# Altium schematic sheet Temp-RH_Sensor_Unit_board.SchDoc
size A2
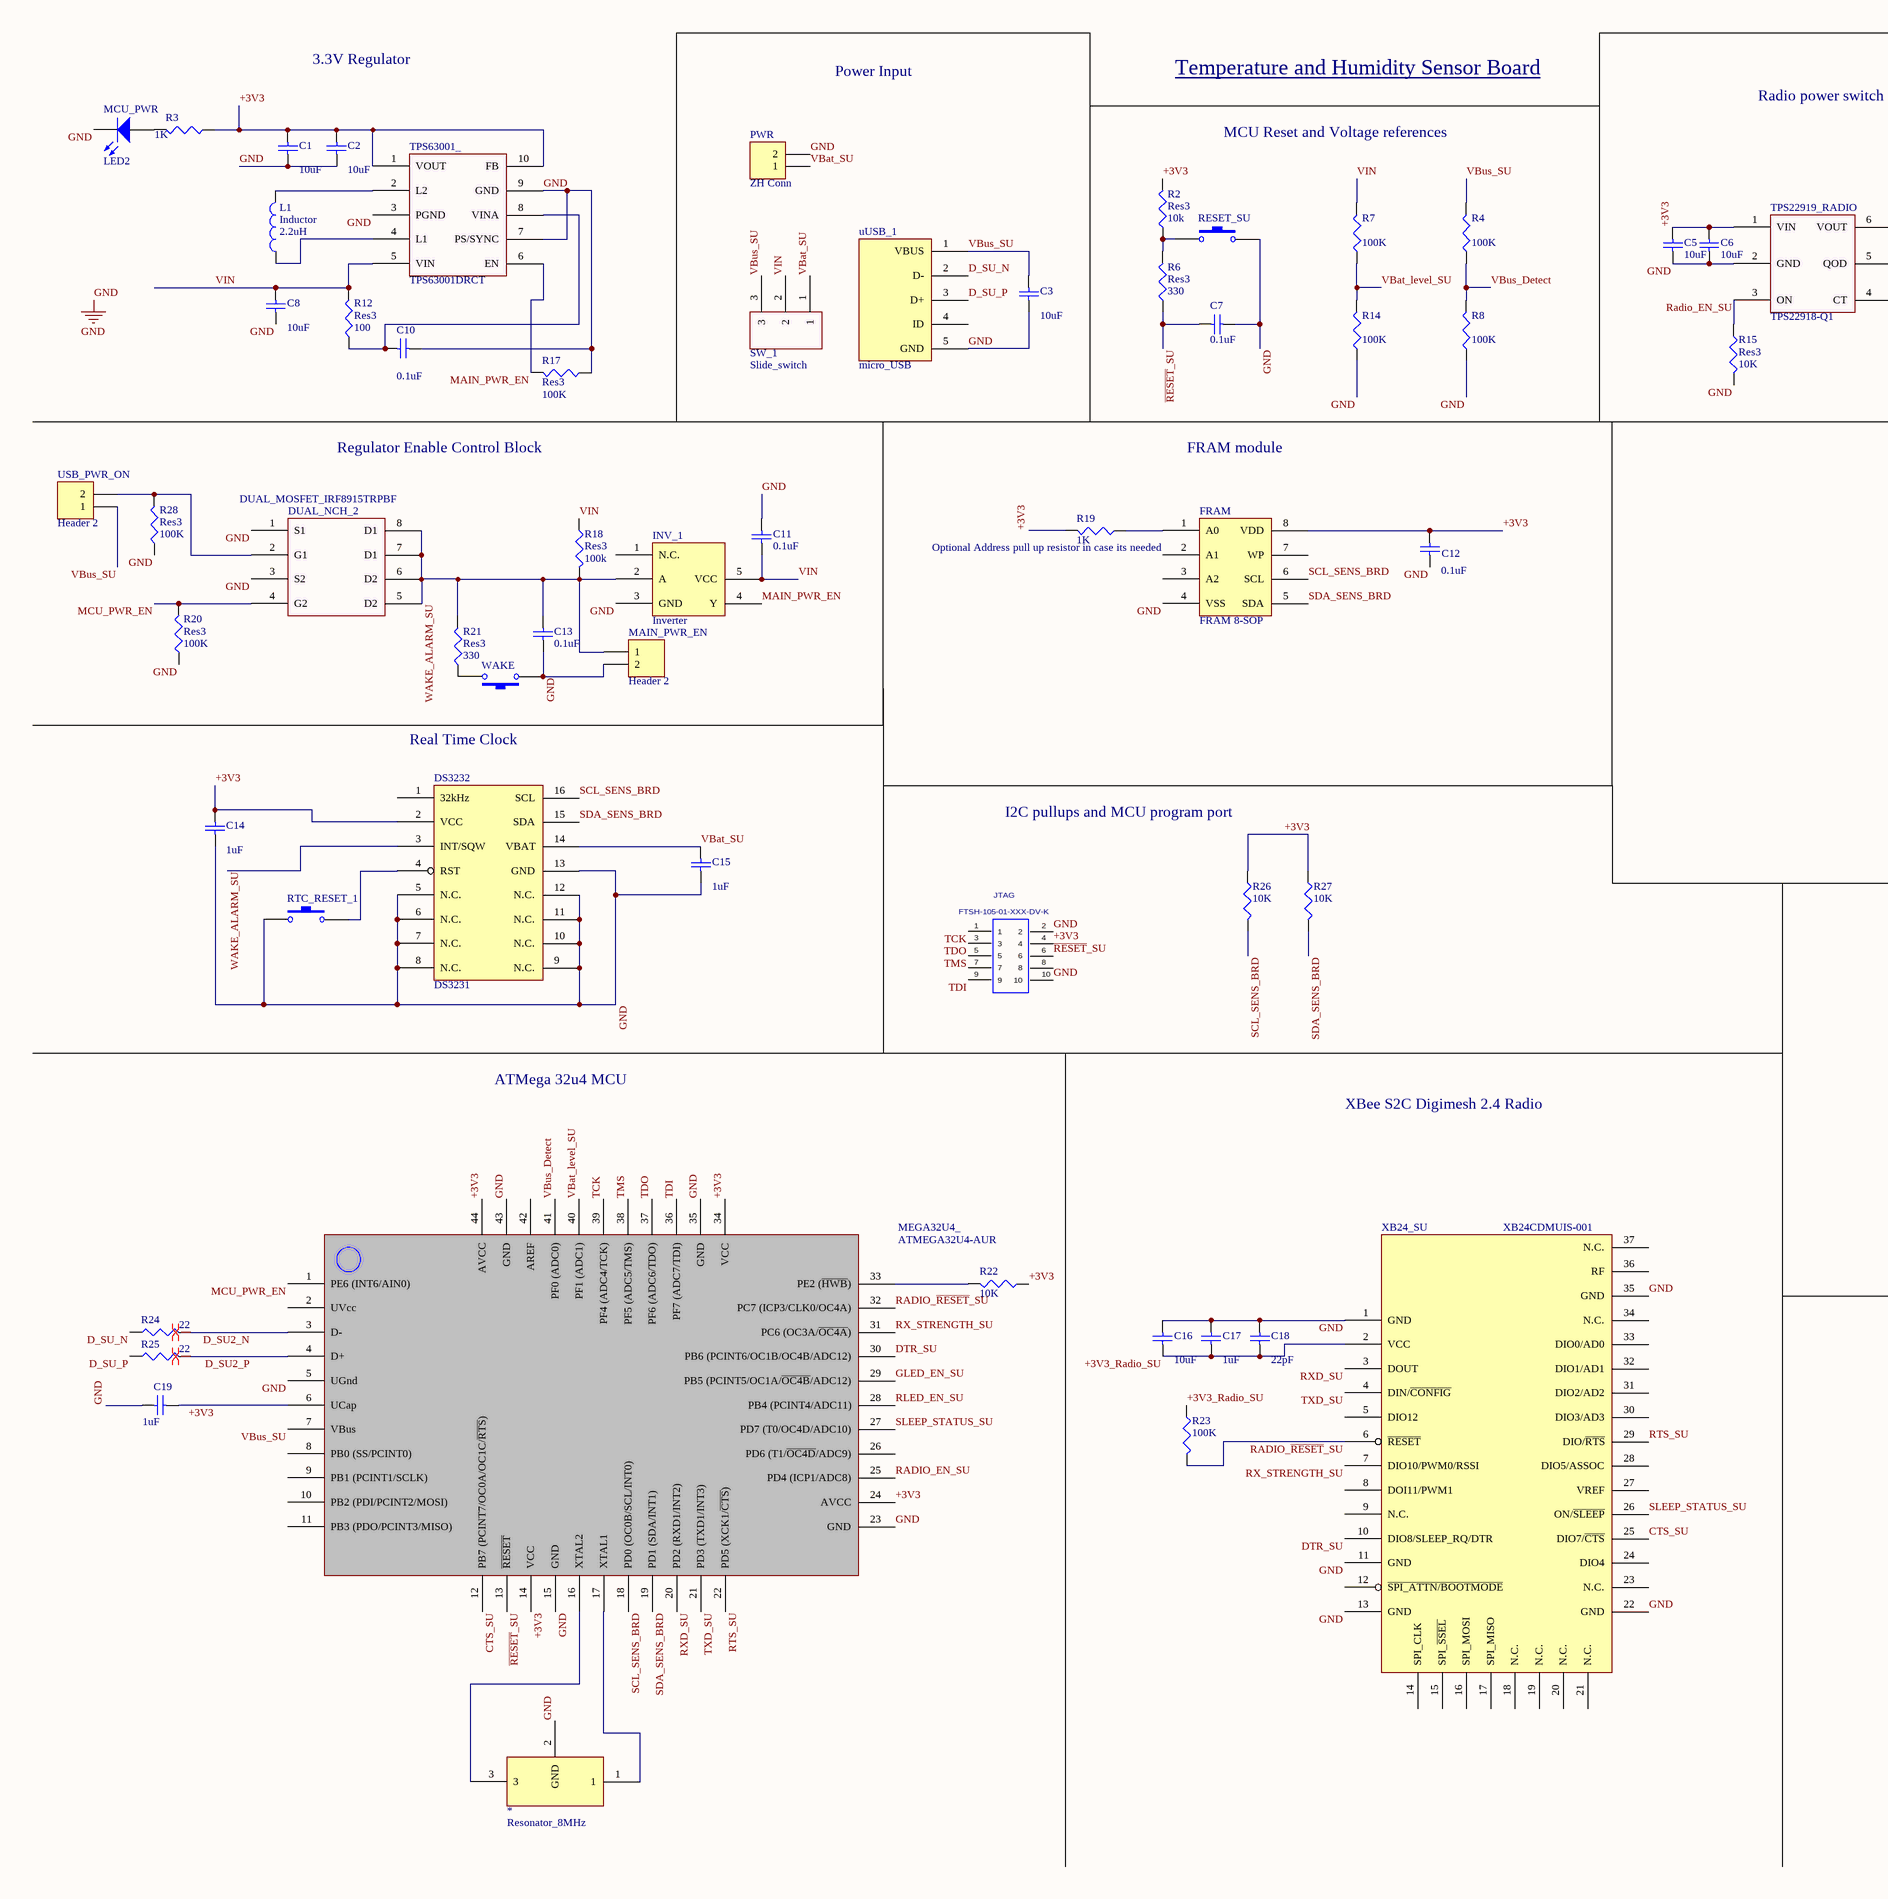
[diagram p0: Temp-RH_Sensor_Unit_board.SchDoc, left]
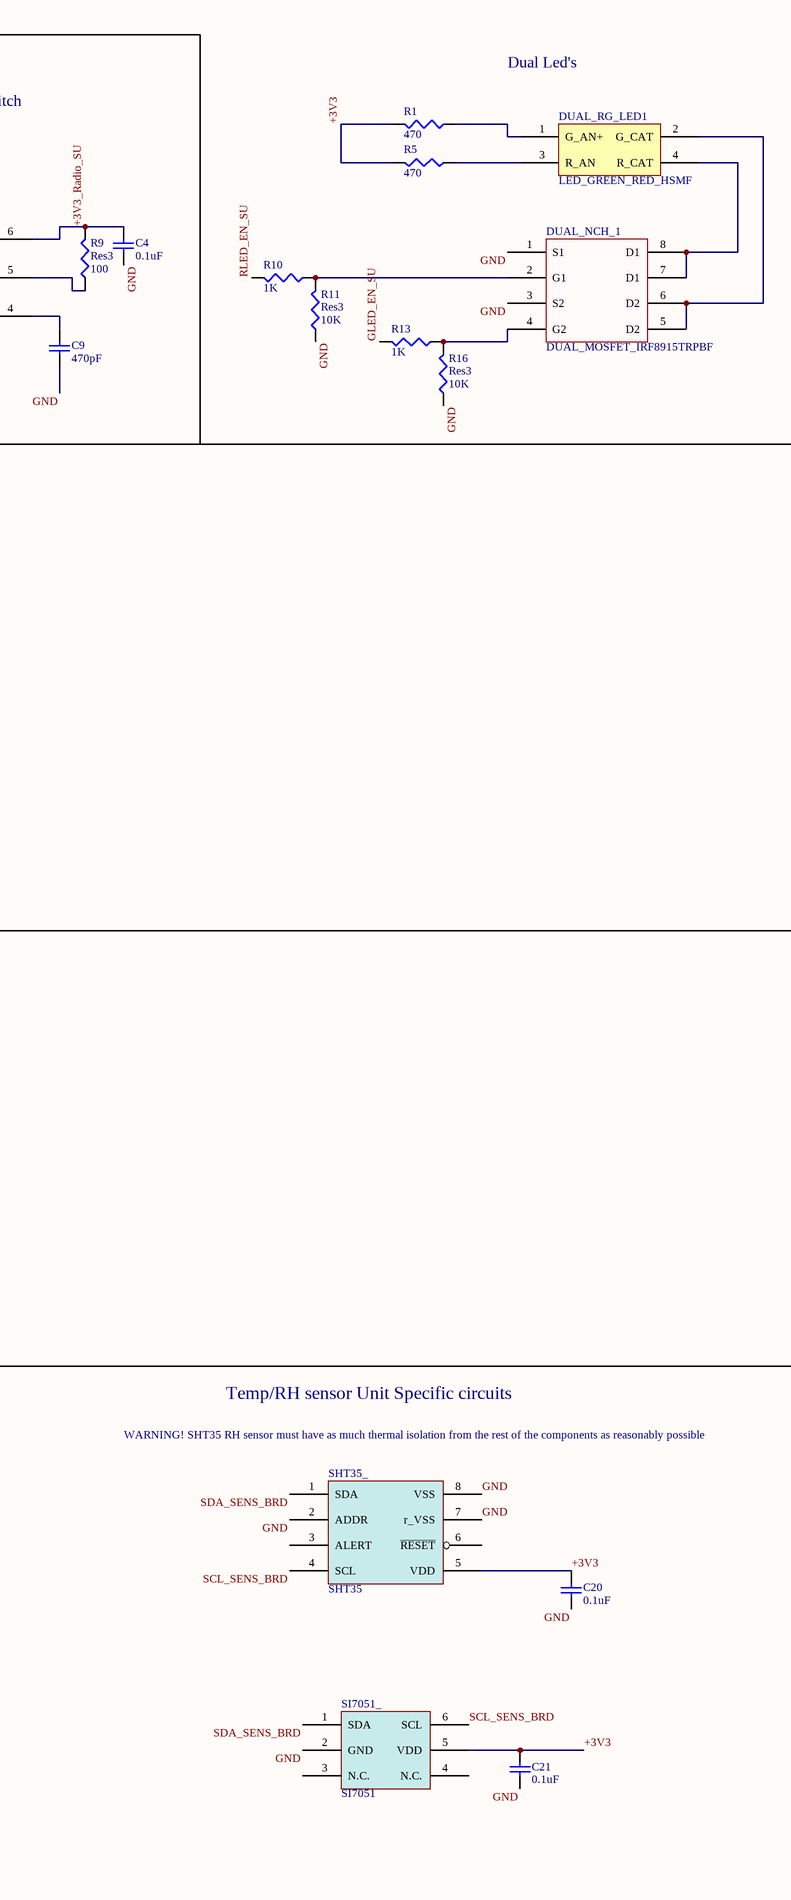
[diagram p1: Temp-RH_Sensor_Unit_board.SchDoc, right]

## Parts
*  Resonator_8MHz  [Resonator_8MHz]
C1  value 10uF  [1608[0603]]  (hidden comment: Cap Semi)
C2  value 10uF  [1608[0603]]  (hidden comment: Cap Semi)
C3  value 10uF  [1608[0603]]  (hidden comment: Cap Semi)
C4  value 0.1uF  [C0805]  (hidden comment: Cap Semi)
C5  value 10uF  [C0805]  (hidden comment: Cap Semi)
C6  value 10uF  [C0805]  (hidden comment: Cap Semi)
C7  value 0.1uF  [C0805]  (hidden comment: Cap Semi)
C8  value 10uF  [1608[0603]]  (hidden comment: Cap Semi)
C9  value 470pF  [C0805]  (hidden comment: Cap Semi)
C10  value 0.1uF  [C0805]  (hidden comment: Cap Semi)
C11  value 0.1uF  [C0805]  (hidden comment: Cap Semi)
C12  value 0.1uF  [C0805]  (hidden comment: Cap Semi)
C13  value 0.1uF  [C0805]  (hidden comment: Cap Semi)
C14  value 1uF  [C0805]  (hidden comment: Cap Semi)
C15  value 1uF  [C0805]  (hidden comment: Cap Semi)
C16  value 10uF  [1608[0603]]  (hidden comment: Cap Semi)
C17  value 1uF  [C0805]  (hidden comment: Cap Semi)
C18  value 22pF  [1608[0603]]  (hidden comment: Cap Semi)
C19  value 1uF  [C0805]  (hidden comment: Cap Semi)
C20  value 0.1uF  [C0805]  (hidden comment: Cap Semi)
C21  value 0.1uF  [C0805]  (hidden comment: Cap Semi)
DS3232  DS3231  [16 SO]
DUAL_NCH_1  DUAL_MOSFET_IRF8915TRPBF  [SOP-8]
DUAL_NCH_2  DUAL_MOSFET_IRF8915TRPBF  [SOP-8]
DUAL_RG_LED1  LED_GREEN_RED_HSMF  [LED4]
FRAM  FRAM 8-SOP  [SOP-8]
INV_1  Inverter  [SOT-23]
JTAG  FTSH-105-01-XXX-DV-K  [FTSH-105-01-XXX-DV-K]
L1  Inductor  value 2.2uH  [2.2uH_Inductor]
MAIN_PWR_EN  Header 2  [HDR1X2]
MCU_PWR  LED2  [LED_Single_Orange]
MEGA32U4_  ATMEGA32U4-AUR  [Quad44]
PWR  ZH Conn  [ZH Series Header - 2 Position]
R1  value 470  [6-0805_N]  (hidden comment: Res3)
R2  Res3  value 10k  [6-0805_N]
R3  value 1K  [6-0805_N]  (hidden comment: Res3)
R4  value 100K  [6-0805_N]  (hidden comment: Res3)
R5  value 470  [6-0805_N]  (hidden comment: Res3)
R6  Res3  value 330  [6-0805_N]
R7  value 100K  [6-0805_N]  (hidden comment: Res3)
R8  value 100K  [6-0805_N]  (hidden comment: Res3)
R9  Res3  value 100  [6-0805_N]
R10  value 1K  [6-0805_N]  (hidden comment: Res3)
R11  Res3  value 10K  [6-0805_N]
R12  Res3  value 100  [6-0805_N]
R13  value 1K  [6-0805_N]  (hidden comment: Res3)
R14  value 100K  [6-0805_N]  (hidden comment: Res3)
R15  Res3  value 10K  [6-0805_N]
R16  Res3  value 10K  [6-0805_N]
R17  Res3  value 100K  [6-0805_N]
R18  Res3  value 100k  [6-0805_N]
R19  value 1K  [6-0805_N]  (hidden comment: Res3)
R20  Res3  value 100K  [6-0805_N]
R21  Res3  value 330  [6-0805_N]
R22  value 10K  [6-0805_N]  (hidden comment: Res3)
R23  value 100K  [6-0805_N]  (hidden comment: Res3)
R24  value 22  [6-0805_N]  (hidden comment: Res3)
R25  value 22  [6-0805_N]  (hidden comment: Res3)
R26  value 10K  [6-0805_N]  (hidden comment: Res3)
R27  value 10K  [6-0805_N]  (hidden comment: Res3)
R28  Res3  value 100K  [6-0805_N]
RESET_SU  SW-PB  [SW_TACTILE]  (value not drawn)
RTC_RESET_1  SW-PB  [SW_TACTILE]  (value not drawn)
SHT35_  SHT35  [SHT35 - small]
SI7051_  SI7051  [SI7051 - small]
SW_1  Slide_switch  [Slide_SW]
TPS22919_RADIO  TPS22918-Q1  [SOT-23-6]
TPS63001_  TPS63001DRCT  [SON10 - small]
USB_PWR_ON  Header 2  [HDR1X2]
uUSB_1  micro_USB  [MicroUSB_CONN]
WAKE  SW-PB  [SW_TACTILE]  (value not drawn)
XB24_SU  XB24CDMUIS-001  [XB24_RADIO]

## Nets
GND: *.2(GND) C1.2 C2.2 C3.1 C4.2 C5.2 C6.2 C7.1 C8.1 C9.2 C10.1 C11.1 C12.1 C13.2 C14.1 C15.1 C16.2 C17.2 C18.2 C19.1 C20.1 C21.1 DS3232.5(N.C.) DS3232.6(N.C.) DS3232.7(N.C.) DS3232.8(N.C.) DS3232.9(N.C.) DS3232.10(N.C.) DS3232.11(N.C.) DS3232.12(N.C.) DS3232.13(GND) DUAL_NCH_1.1(S1) DUAL_NCH_1.3(S2) DUAL_NCH_2.1(S1) DUAL_NCH_2.3(S2) FRAM.4(VSS) INV_1.3(GND) JTAG.2 JTAG.10 MAIN_PWR_EN.2 MCU_PWR.2(K) MEGA32U4_.5(UGnd) MEGA32U4_.15(GND) MEGA32U4_.23(GND) MEGA32U4_.35(GND) MEGA32U4_.43(GND) PWR.2 R8.1 R11.1 R14.1 R15.2 R16.1 R17.1 R20.1 R28.1 RESET_SU.2 RTC_RESET_1.1 SHT35_.2(ADDR) SHT35_.7(r_VSS) SHT35_.8(VSS) SI7051_.2(GND) TPS22919_RADIO.2(GND) TPS63001_.3(PGND) TPS63001_.7(PS/SYNC) TPS63001_.9(GND) uUSB_1.5(GND) WAKE.1 XB24_SU.1(GND) XB24_SU.11(GND) XB24_SU.13(GND) XB24_SU.22(GND) XB24_SU.35(GND)
+3V3: C1.1 C2.1 C5.1 C6.1 C12.2 C14.2 C19.2 C20.2 C21.2 DS3232.2(VCC) FRAM.8(VDD) JTAG.4 MEGA32U4_.6(UCap) MEGA32U4_.14(VCC) MEGA32U4_.24(AVCC) MEGA32U4_.34(VCC) MEGA32U4_.44(AVCC) R1.2 R2.2 R3.1 R5.2 R19.2 R22.1 R26.1 R27.1 SHT35_.5(VDD) SI7051_.5(VDD) TPS22919_RADIO.1(VIN) TPS63001_.1(VOUT) TPS63001_.10(FB)
+3V3_Radio_SU: C4.1 C16.1 C17.1 C18.1 R9.2 R23.1 TPS22919_RADIO.6(VOUT) XB24_SU.2(VCC)
CTS_SU: MEGA32U4_.12(PB7_(PCINT7/OC0A/OC1C/~{RTS})) XB24_SU.25(DIO7/~{CTS})
D_SU2_N: MEGA32U4_.3(D-) R24.2
D_SU2_P: MEGA32U4_.4(D+) R25.2
D_SU_N: R24.1 uUSB_1.2(D-)
D_SU_P: R25.1 uUSB_1.3(D+)
DTR_SU: MEGA32U4_.30(PB6_(PCINT6/OC1B/OC4B/ADC12)) XB24_SU.10(DIO8/SLEEP_RQ/DTR)
GLED_EN_SU: MEGA32U4_.29(PB5_(PCINT5/OC1A/~{OC4B}/ADC12)) R13.2
MAIN_PWR_EN: INV_1.4(Y) R17.2 TPS63001_.6(EN)
MCU_PWR_EN: DUAL_NCH_2.4(G2) MEGA32U4_.1(PE6_(INT6/AIN0)) R20.2
~{RESET}_SU: C7.2 JTAG.6 MEGA32U4_.13(~{RESET}) R6.1
Radio_EN_SU: MEGA32U4_.25(PD4_(ICP1/ADC8)) R15.1 TPS22919_RADIO.3(ON)
RADIO_~{RESET}_SU: MEGA32U4_.32(PC7_(ICP3/CLK0/OC4A)) R23.2 XB24_SU.6(~{RESET})
RLED_EN_SU: MEGA32U4_.28(PB4_(PCINT4/ADC11)) R10.2
RTS_SU: MEGA32U4_.22(PD5_(XCK1/~{CTS})) XB24_SU.29(DIO/~{RTS})
RX_STRENGTH_SU: MEGA32U4_.31(PC6_(OC3A/~{OC4A})) XB24_SU.7(DIO10/PWM0/RSSI)
RXD_SU: MEGA32U4_.20(PD2_(RXD1/INT2)) XB24_SU.3(DOUT)
SCL_SENS_BRD: DS3232.16(SCL) FRAM.6(SCL) MEGA32U4_.18(PD0_(OC0B/SCL/INT0)) R26.2 SHT35_.4(SCL) SI7051_.6(SCL)
SDA_SENS_BRD: DS3232.15(SDA) FRAM.5(SDA) MEGA32U4_.19(PD1_(SDA/INT1)) R27.2 SHT35_.1(SDA) SI7051_.1(SDA)
SLEEP_STATUS_SU: MEGA32U4_.27(PD7_(T0/OC4D/ADC10)) XB24_SU.26(ON/~{SLEEP})
TCK: JTAG.1 MEGA32U4_.39(PF4_(ADC4/TCK))
TDI: JTAG.9 MEGA32U4_.36(PF7_(ADC7/TDI))
TDO: JTAG.3 MEGA32U4_.37(PF6_(ADC6/TDO))
TMS: JTAG.5 MEGA32U4_.38(PF5_(ADC5/TMS))
TXD_SU: MEGA32U4_.21(PD3_(TXD1/INT3)) XB24_SU.4(DIN/~{CONFIG})
VBat_level_SU: MEGA32U4_.40(PF1_(ADC1)) R7.1 R14.2
VBat_SU: C15.2 DS3232.14(VBAT) PWR.1 SW_1.1
VBus_Detect: MEGA32U4_.41(PF0_(ADC0)) R4.1 R8.2
VBus_SU: C3.2 MEGA32U4_.7(VBus) R4.2 SW_1.3 USB_PWR_ON.1 uUSB_1.1(VBUS)
VIN: C8.2 C11.2 INV_1.5(VCC) R7.2 R12.2 R18.1 SW_1.2 TPS63001_.5(VIN)
WAKE_ALARM_SU: C13.1 DS3232.3(INT/SQW) DUAL_NCH_2.5(D2) DUAL_NCH_2.6(D2) DUAL_NCH_2.7(D1) DUAL_NCH_2.8(D1) INV_1.2(A) MAIN_PWR_EN.1 R18.2 R21.2
Net*_1: *.1 MEGA32U4_.17(XTAL1)
Net*_3: *.3 MEGA32U4_.16(XTAL2)
NetC9_1: C9.1 TPS22919_RADIO.4(CT)
NetC10_2: C10.2 R12.1 TPS63001_.8(VINA)
NetDS3232_4: DS3232.4(RST) RTC_RESET_1.2
NetDUAL_NCH_1_2: DUAL_NCH_1.2(G1) R10.1 R11.2
NetDUAL_NCH_1_4: DUAL_NCH_1.4(G2) R13.1 R16.2
NetDUAL_NCH_1_5: DUAL_NCH_1.5(D2) DUAL_NCH_1.6(D2) DUAL_RG_LED1.2(G_CAT)
NetDUAL_NCH_1_7: DUAL_NCH_1.7(D1) DUAL_NCH_1.8(D1) DUAL_RG_LED1.4(R_CAT)
NetDUAL_NCH_2_2: DUAL_NCH_2.2(G1) R28.2 USB_PWR_ON.2
NetDUAL_RG_LED1_1: DUAL_RG_LED1.1(G_AN+) R1.1
NetDUAL_RG_LED1_3: DUAL_RG_LED1.3(R_AN) R5.1
NetFRAM_1: FRAM.1(A0) R19.1
NetL1_1: L1.1 TPS63001_.4(L1)
NetL1_2: L1.2 TPS63001_.2(L2)
NetMCU_PWR_1: MCU_PWR.1(A) R3.2
NetMEGA32U4__33: MEGA32U4_.33(PE2_(~{HWB})) R22.2
NetR2_1: R2.1 R6.2 RESET_SU.1
NetR9_1: R9.1 TPS22919_RADIO.5(QOD)
NetR21_1: R21.1 WAKE.2

Not connected (* = marked no-connect by the designer): DS3232 1(32kHz); FRAM 2(A1) 3(A2) 7(WP); INV_1 1(N.C.); JTAG 7 8; MEGA32U4_ 2(UVcc) 8(PB0_(SS/PCINT0)) 9(PB1_(PCINT1/SCLK)) 10(PB2_(PDI/PCINT2/MOSI)) 11(PB3_(PDO/PCINT3/MISO)) 26(PD6_(T1/~{OC4D}/ADC9)) 42(AREF); SHT35_ 3(ALERT) 6(~{RESET}); SI7051_ 3(N.C.) 4(N.C.); uUSB_1 4(ID); XB24_SU 5(DIO12) 8(DOI11/PWM1) 9(N.C.) 12(~{SPI_ATTN/BOOTMODE}) 14(SPI_CLK) 15(SPI_~{SSEL}) 16(SPI_MOSI) 17(SPI_MISO) 18(N.C.) 19(N.C.) 20(N.C.) 21(N.C.) 23(N.C.) 24(DIO4) 27(VREF) 28(DIO5/ASSOC) 30(DIO3/AD3) 31(DIO2/AD2) 32(DIO1/AD1) 33(DIO0/AD0) 34(N.C.) 36(RF) 37(N.C.)

## Layout directives
differential pair: D_SU2_N, D_SU2_P

## Notes on the sheet
- 3.3V Regulator
- Power Input
- Temperature and Humidity Sensor Board
- Radio power switch
- Dual Led's
- MCU Reset and Voltage references
- Regulator Enable Control Block
- FRAM module
- (near FRAM) Optional Address pull up resistor in case its needed
- Real Time Clock
- I2C pullups and MCU program port
- ATMega 32u4 MCU
- XBee S2C Digimesh 2.4 Radio
- WARNING! SHT35 RH sensor must have as much thermal isolation from the rest of the components as reasonably possible
- Temp/RH sensor Unit Specific circuits

## Library data of the parts
C1-C21 = Cap Semi: Capacitor (Semiconductor SIM Model); Published: 8-Jun-2000; LatestRevisionDate: 29-May-2009; LatestRevisionNote: IPC-7351 Footprint Added.; PackageReference: C1206; Publisher: Altium Limited; PackageDescription: Chip Capacitor
INV_1 = SN74LVC1GU04
JTAG = FTSH-105-01-XXX-DV-K: TERMINAL STRIP, .050"(1.27mm) PITCH, 10 PINS, KEYED; MANUFACTURER: SAMTEC; CREATED: November 30, 2016 - Wendy Xin; PCB DECAL: FTSH-105-01-XXX-DV-K
L1 = Inductor: Code_IEC: 1005; Published: 8-Jun-2000; LatestRevisionDate: 29-May-2009; LatestRevisionNote: IPC-7351 Footprint Added.; PackageReference: 0402-A; Publisher: Altium Limited; PackageDescription: Chip Inductor; Code_JEITA: 0402
MAIN_PWR_EN PWR USB_PWR_ON = Header 2: Header, 2-Pin; LatestRevisionDate: 17-Jul-2002; LatestRevisionNote: Re-released for DXP Platform.; Publisher: Altium Limited
MCU_PWR = LED2: Typical RED, GREEN, YELLOW, AMBER GaAs LED; Published: 8-Jun-2000; LatestRevisionDate: 17-Jul-2002; LatestRevisionNote: Re-released for DXP Platform.; PackageVersion: Feb-2002; PackageReference: 3.2X1.6X1.1; Publisher: Altium Limited; PackageDescription: SM LED; 2 Flat Leads
R1-R28 = Res3: Resistor; Published: 8-Jun-2000; LatestRevisionDate: 29-May-2009; LatestRevisionNote: IPC-7351 Footprint Added.; PackageReference: J1-0603; Publisher: Altium Limited; PackageDescription: Chip Resistor
RESET_SU RTC_RESET_1 WAKE = SW-PB: Switch; Published: 24-Mar-1999; LatestRevisionDate: 17-Jul-2002; LatestRevisionNote: Re-released for DXP Platform.; PackageReference: SPST-2; Publisher: Altium Limited; PackageDescription: Switch; 2 Leads